# EAGLE schematic base (EAGLE 8.3.1)
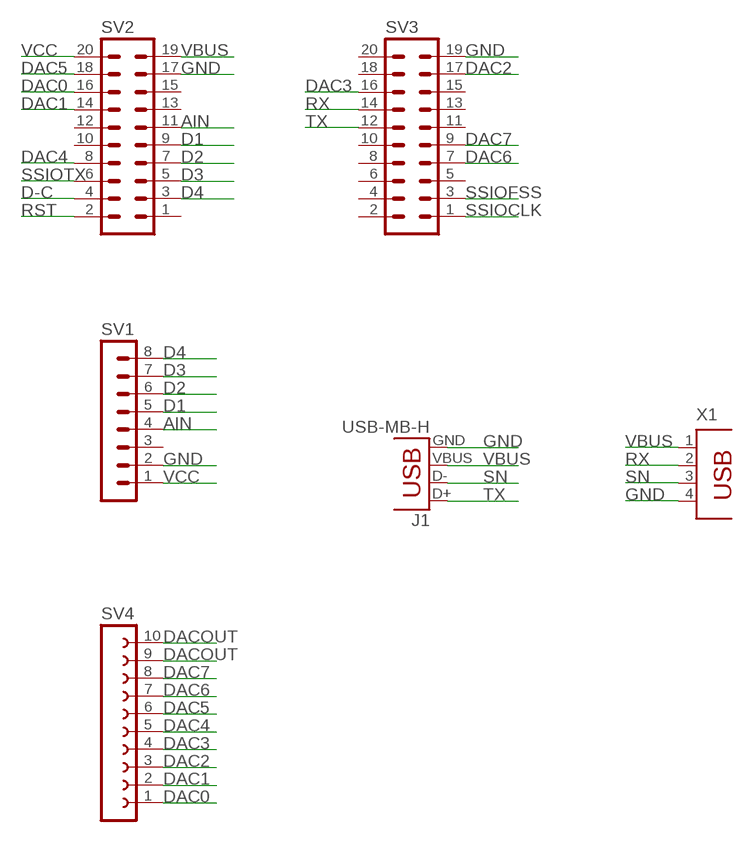
[diagram p0: schematic, sheet 1]

## Parts
J1  USB-MB-H  [USB-MB-H]
SV1  MA08-1  [MA08-1]
SV2  MA10-2  [MA10-2]
SV3  MA10-2  [MA10-2]
SV4  FE10-1  [FE10]
X1  PN87520  [PN87520]

## Nets
AIN: SV1.4 SV2.11
D1: SV1.5 SV2.9
D2: SV1.6 SV2.7
D3: SV1.7 SV2.5
D4: SV1.8 SV2.3
D-C: SV2.4
DAC0: SV2.16 SV4.1
DAC1: SV2.14 SV4.2
DAC2: SV3.17 SV4.3
DAC3: SV3.16 SV4.4
DAC4: SV2.8 SV4.5
DAC5: SV2.18 SV4.6
DAC6: SV3.7 SV4.7
DAC7: SV3.9 SV4.8
DACOUT: SV4.9 SV4.10
GND: J1.GND SV1.2 SV2.17 SV3.19 X1.4
RST: SV2.2
RX: SV3.14 X1.2
SN: J1.D- X1.3
SSIOCLK: SV3.1
SSIOFSS: SV3.3
SSIOTX: SV2.6
TX: J1.D+ SV3.12
VBUS: J1.VBUS SV2.19 X1.1
VCC: SV1.1 SV2.20
Unconnected: SV1.3 SV2.1 SV2.10 SV2.12 SV2.13 SV2.15 SV3.2 SV3.4 SV3.5 SV3.6 SV3.8 SV3.10 SV3.11 SV3.13 SV3.15 SV3.18 SV3.20

## Library data of the parts
J1 = SparkFun-Retired:USB: USB Connectors USB-B-PTH is fully proven SKU : PRT-00139/CONN-08278 USB-miniB is fully proven SKU : PRT-00587 USB-A-PCB is untested. USB-A-H is throughly reviewed, but untested. Spark Fun Electronics SKU : PRT-00437 USB-B-SMT is throughly reviewed, but untested. Needs silkscreen touching up. USB-A-S has not been used/tested USB-MB-H has not been used/tested USB-MICROB has been used. CONN-09505
SV1 = con-lstb:MA08-1: PIN HEADER; OC_FARNELL: unknown; OC_NEWARK: unknown
SV2 SV3 = con-lstb:MA10-2: PIN HEADER; OC_FARNELL: unknown; OC_NEWARK: unknown
SV4 = con-lsta:FE10-1: FEMALE HEADER; OC_FARNELL: unknown; OC_NEWARK: unknown
X1 = con-berg:PN87520: BERG USB connector; OC_FARNELL: unknown; OC_NEWARK: unknown